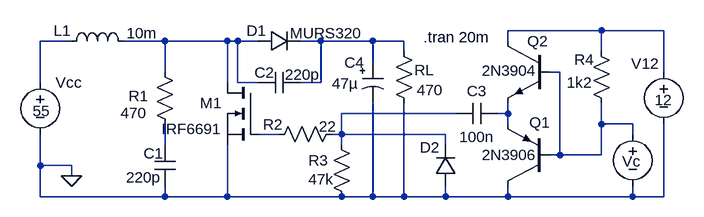
[diagram p0: schematic Trl1564BoostCnv.asc]
Trl1564BoostCnv.asc, the LTspice schematic file:
Version 4
SHEET 1 1044 680
WIRE 736 96 592 96
WIRE 832 96 736 96
WIRE -80 112 -128 112
WIRE 64 112 0 112
WIRE 160 112 64 112
WIRE 176 112 160 112
WIRE 208 112 176 112
WIRE 304 112 272 112
WIRE 384 112 304 112
WIRE 432 112 384 112
WIRE 592 112 592 96
WIRE 432 128 432 112
WIRE 736 128 736 96
WIRE 384 144 384 112
WIRE 64 160 64 112
WIRE 672 160 656 160
WIRE 832 160 832 96
WIRE -128 176 -128 112
WIRE 160 176 160 112
WIRE 176 176 176 112
WIRE 208 176 176 176
WIRE 304 176 304 112
WIRE 304 176 272 176
WIRE 512 224 336 224
WIRE 592 224 592 208
WIRE 592 224 576 224
WIRE 592 240 592 224
WIRE 736 240 736 208
WIRE 784 240 736 240
WIRE 240 256 208 256
WIRE 336 256 336 224
WIRE 336 256 320 256
WIRE 496 256 336 256
WIRE 784 256 784 240
WIRE 64 272 64 240
WIRE 336 272 336 256
WIRE 496 272 496 256
WIRE 672 288 672 160
WIRE 672 288 656 288
WIRE 736 288 736 240
WIRE 736 288 672 288
WIRE -128 304 -128 256
WIRE -80 304 -128 304
WIRE -80 320 -80 304
WIRE -128 352 -128 304
WIRE 64 352 64 336
WIRE 64 352 -128 352
WIRE 160 352 160 272
WIRE 160 352 64 352
WIRE 336 352 160 352
WIRE 384 352 384 208
WIRE 384 352 336 352
WIRE 432 352 432 208
WIRE 432 352 384 352
WIRE 496 352 496 336
WIRE 496 352 432 352
WIRE 592 352 592 336
WIRE 592 352 496 352
WIRE 784 352 784 336
WIRE 784 352 592 352
WIRE 832 352 832 240
WIRE 832 352 784 352
FLAG -80 320 0
SYMBOL ind -96 128 R270
WINDOW 0 16 2 VTop 0
WINDOW 3 44 125 VBottom 0
SYMATTR InstName L1
SYMATTR Value 10m
SYMATTR SpiceLine Rser=1
SYMBOL voltage -128 160 R0
WINDOW 3 -12 60 Left 0
WINDOW 123 0 0 Left 0
SYMATTR InstName Vcc
SYMATTR Value 55
SYMATTR SpiceLine Rser=1m
SYMBOL res 48 144 R0
WINDOW 0 -40 53 Left 0
WINDOW 3 -52 79 Left 0
SYMATTR InstName R1
SYMATTR Value 470
SYMBOL cap 48 272 R0
WINDOW 0 -17 13 Left 0
WINDOW 3 -44 50 Left 0
SYMATTR InstName C1
SYMATTR Value 220p
SYMBOL diode 208 96 M90
WINDOW 0 16 -3 VBottom 0
WINDOW 3 -12 104 VTop 0
SYMATTR InstName D1
SYMATTR Value MURS320
SYMBOL cap 272 160 R90
WINDOW 0 16 55 VBottom 0
WINDOW 3 -12 -4 VTop 0
SYMATTR InstName C2
SYMATTR Value 220p
SYMBOL nmos 208 176 M0
SYMATTR InstName M1
SYMATTR Value IRF6691
SYMBOL res 336 240 R90
WINDOW 0 16 106 VBottom 0
WINDOW 3 -12 21 VTop 0
SYMATTR InstName R2
SYMATTR Value 22
SYMBOL res 320 256 R0
WINDOW 0 -35 40 Left 0
WINDOW 3 -35 69 Left 0
SYMATTR InstName R3
SYMATTR Value 47k
SYMBOL diode 512 336 R180
WINDOW 0 25 60 Left 0
WINDOW 3 24 0 Invisible 0
SYMATTR InstName D2
SYMATTR Value 1N914
SYMBOL pnp 656 336 R180
WINDOW 0 -1 98 Left 0
WINDOW 3 19 48 Left 0
SYMATTR InstName Q1
SYMATTR Value 2N3906
SYMBOL npn 656 112 M0
WINDOW 0 2 0 Left 0
WINDOW 3 19 46 Left 0
SYMATTR InstName Q2
SYMATTR Value 2N3904
SYMBOL res 720 112 R0
WINDOW 0 -26 29 Left 0
WINDOW 3 -37 64 Left 0
SYMATTR InstName R4
SYMATTR Value 1k2
SYMBOL voltage 832 144 R0
WINDOW 0 -50 3 Left 0
WINDOW 3 -14 59 Left 0
WINDOW 123 0 0 Left 0
SYMATTR InstName V12
SYMATTR Value 12
SYMATTR SpiceLine Rser=1
SYMBOL cap 576 208 R90
WINDOW 0 -3 32 VBottom 0
WINDOW 3 36 32 VTop 0
SYMATTR InstName C3
SYMATTR Value 100n
SYMBOL voltage 784 240 R0
WINDOW 0 -16 58 Left 0
WINDOW 3 -354 79 Invisible 0
WINDOW 123 0 0 Left 0
SYMATTR InstName Vc
SYMATTR Value PULSE(0 10 0 1u 1u 12u 25u)
SYMATTR SpiceLine Rser=220
SYMBOL polcap 368 144 R0
WINDOW 0 -28 1 Left 0
WINDOW 3 -47 34 Left 0
SYMATTR InstName C4
SYMATTR Value 47µ
SYMATTR Description Capacitor
SYMATTR Type cap
SYMATTR SpiceLine V=100 Irms=210m Rser=0.37 MTBF=2000 Lser=0 mfg="Nichicon" pn="UPR2A470MPH" type="Al electrolytic" ppPkg=1
SYMBOL res 416 112 R0
WINDOW 0 32 45 Left 0
SYMATTR InstName RL
SYMATTR Value 470
TEXT 462 106 Left 0 !.tran 20m

The netlist it stands for:
* Trl1564BoostCnv.asc
L1 N002 N003 10m Rser=1
Vcc N002 0 55 Rser=1m
R1 N003 N009 470
C1 N009 0 220p
D1 N003 N004 MURS320
C2 N004 N003 220p
M1 N003 N008 0 0 IRF6691
R2 N006 N008 22
R3 N006 0 47k
D2 0 N006 1N914
Q1 0 N005 N007 0 2N3906
Q2 N001 N005 N007 0 2N3904
R4 N001 N005 1k2
V12 N001 0 12 Rser=1
C3 N007 N006 100n
Vc N005 0 PULSE(0 10 0 1u 1u 12u 25u) Rser=220
C4 N004 0 47µ V=100 Irms=210m Rser=0.37 MTBF=2000 Lser=0 mfg="Nichicon" pn="UPR2A470MPH" type="Al electrolytic" ppPkg=1
RL N004 0 470
.model D D
.lib standard.dio
.model NPN NPN
.model PNP PNP
.lib standard.bjt
.model NMOS NMOS
.model PMOS PMOS
.lib standard.mos
.tran 20m
.backanno
.end